# Altium schematic sheet PainRegister_MCU.SchDoc: Электро-регистратор
size 840 x 594 mm; ApprovedBy: Рогов; CheckedBy: Капустин; DrawnBy: Подлесный; DocumentNumber: СКТБ.411126.001 Э3; SheetNumber: 1; SheetTotal: 4; Title1str: болевого синдрома; DocumentType: тип схемы; Format: A1; ImagePath: СКТБ.411126.001
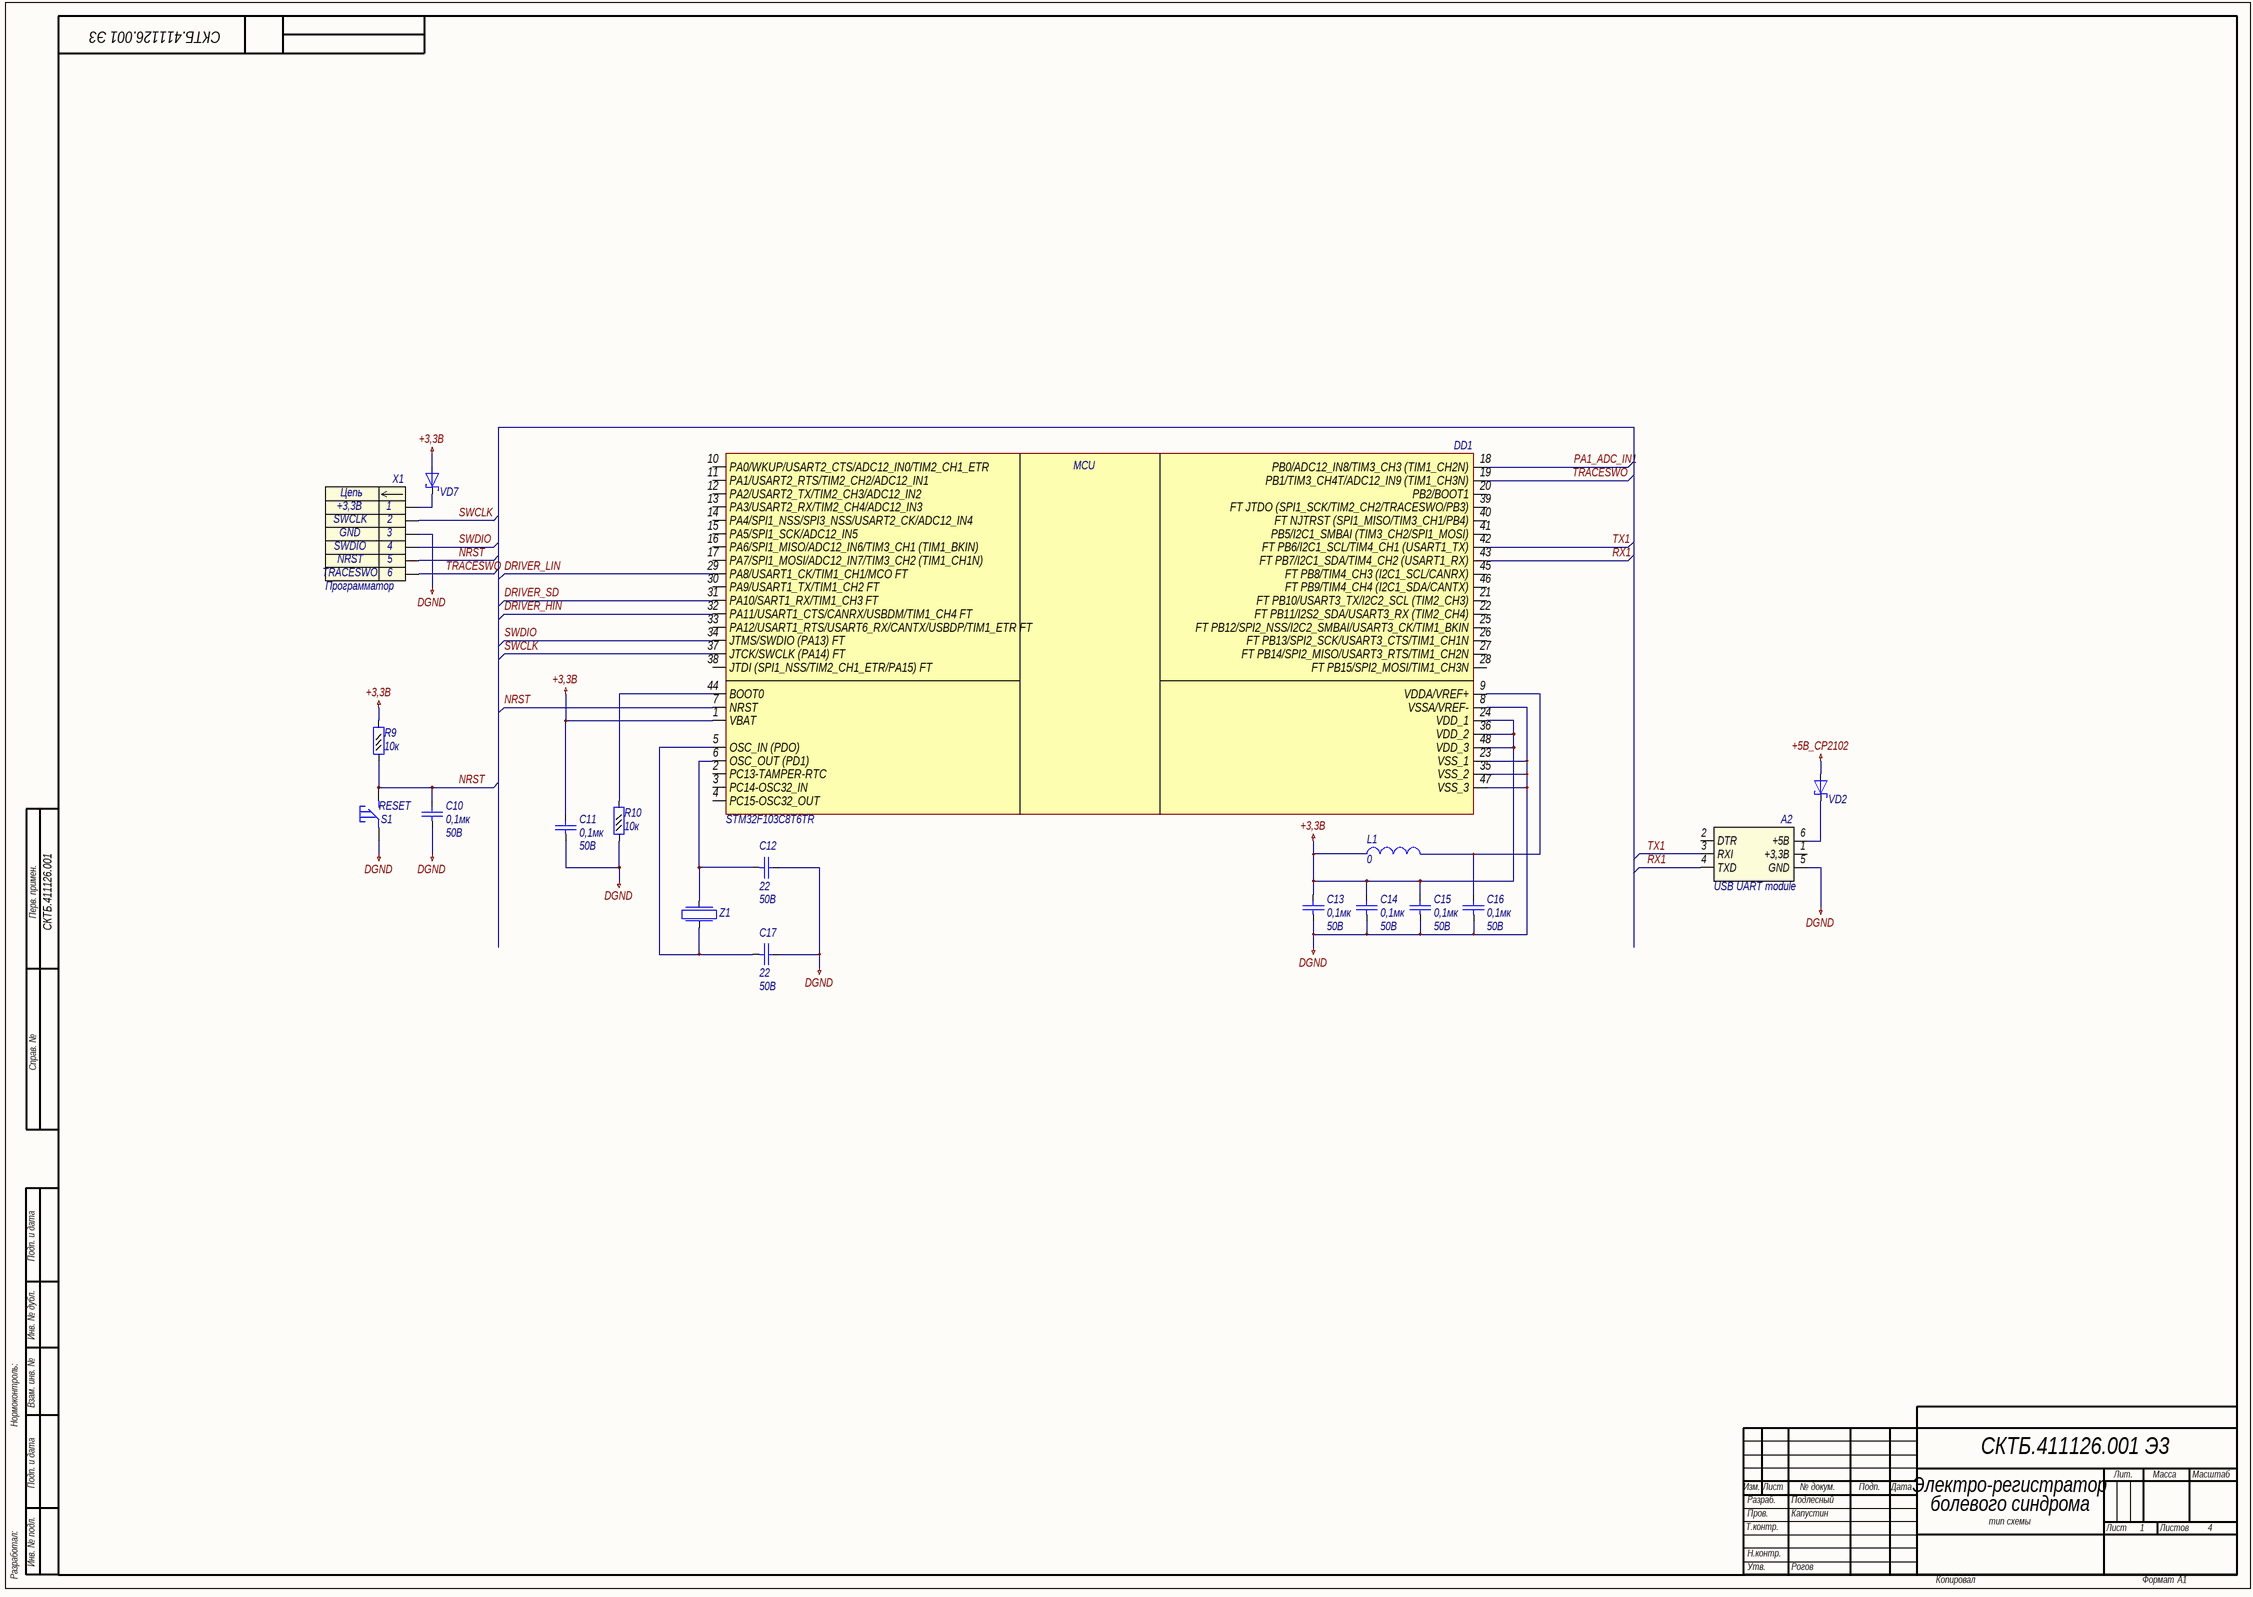
[diagram p0: PainRegister_MCU.SchDoc]

## Parts
A2  USB UART module  [USB UART CP2102]
C10  value 0,1мк  Voltage: 50B  [C0603]  (hidden comment: Capacitor)
C11  value 0,1мк  Voltage: 50B  [C0603]  (hidden comment: Capacitor)
C12  value 22  Voltage: 50B  [C0603]  (hidden comment: Capacitor)
C13  value 0,1мк  Voltage: 50B  [C0603]  (hidden comment: Capacitor)
C14  value 0,1мк  Voltage: 50B  [C0603]  (hidden comment: Capacitor)
C15  value 0,1мк  Voltage: 50B  [C0603]  (hidden comment: Capacitor)
C16  value 0,1мк  Voltage: 50B  [C0603]  (hidden comment: Capacitor)
C17  value 22  Voltage: 50B  [C0603]  (hidden comment: Capacitor)
DD1  STM32F103C8T6TR  [LQFP48]
L1  value 0  [L0603]  (hidden comment: Inductor)
R9  value 10к  [R0603]  (hidden comment: Resistor_0,062Вт)
R10  value 10к  [R0603]  (hidden comment: Resistor_0,062Вт)
S1  RESET  [Button_SMD]
VD2  DiodeSchottky  [SOD-523]  (value not drawn)
VD7  DiodeSchottky  [SOD-523]  (value not drawn)
X1  Программатор  [PLS-6]
Z1  Crystal  [QSMD5.0x3.2x1.0]  (value not drawn)

## Nets
+3,3В: C11.2 C13.2 C14.2 C15.2 DD1.1(VBAT) DD1.24(VDD_1) DD1.36(VDD_2) DD1.48(VDD_3) L1.1 R9.2 VD7.2(A)
+5B_CP2102: VD2.2(A)
DGND: A2.5(GND) C10.1 C11.1 C12.2 C13.1 C14.1 C15.1 C16.1 C17.2 DD1.8(VSSA/VREF-) DD1.23(VSS_1) DD1.35(VSS_2) DD1.47(VSS_3) R10.1 S1.1 X1.3
DRIVER_HIN: DD1.32(PA11/USART1_CTS/CANRX/USBDM/TIM1_CH4_FT)
DRIVER_LIN: DD1.29(PA8/USART1_CK/TIM1_CH1/MCO_FT)
DRIVER_SD: DD1.31(PA10/SART1_RX/TIM1_CH3_FT)
NRST: C10.2 DD1.7(NRST) R9.1 S1.4 X1.5
PA1_ADC_IN1: DD1.18(PB0/ADC12_IN8/TIM3_CH3_(TIM1_CH2N))
RX1: A2.4(TXD) DD1.43(FT_PB7/I2C1_SDA/TIM4_CH2_(USART1_RX))
SWCLK: DD1.37(JTCK/SWCLK_(PA14)_FT) X1.2
SWDIO: DD1.34(JTMS/SWDIO_(PA13)_FT) X1.4
TRACESWO: DD1.19(PB1/TIM3_CH4T/ADC12_IN9_(TIM1_CH3N)) X1.6
TX1: A2.3(RXI) DD1.42(FT_PB6/I2C1_SCL/TIM4_CH1_(USART1_TX))
NetA2_6: A2.6(+5B) VD2.1(K)
NetC12_1: C12.1 DD1.6(OSC_OUT_(PD1)) Z1.2
NetC16_2: C16.2 DD1.9(VDDA/VREF+) L1.2
NetC17_1: C17.1 DD1.5(OSC_IN_(PDO)) Z1.1
NetDD1_44: DD1.44(BOOT0) R10.2
NetVD7_1: VD7.1(K) X1.1

Not connected (* = marked no-connect by the designer): A2 1(+3,3B) 2(DTR); DD1 2(PC13-TAMPER-RTC) 3(PC14-OSC32_IN) 4(PC15-OSC32_OUT) 10(PA0/WKUP/USART2_CTS/ADC12_IN0/TIM2_CH1_ETR) 11(PA1/USART2_RTS/TIM2_CH2/ADC12_IN1) 12(PA2/USART2_TX/TIM2_CH3/ADC12_IN2) 13(PA3/USART2_RX/TIM2_CH4/ADC12_IN3) 14(PA4/SPI1_NSS/SPI3_NSS/USART2_CK/ADC12_IN4) 15(PA5/SPI1_SCK/ADC12_IN5) 16(PA6/SPI1_MISO/ADC12_IN6/TIM3_CH1_(TIM1_BKIN)) 17(PA7/SPI1_MOSI/ADC12_IN7/TIM3_CH2_(TIM1_CH1N)) 20(PB2/BOOT1) 21(FT_PB10/USART3_TX/I2C2_SCL_(TIM2_CH3)) 22(FT_PB11/I2S2_SDA/USART3_RX_(TIM2_CH4)) 25(FT_PB12/SPI2_NSS/I2C2_SMBAI/USART3_CK/TIM1_BKIN) 26(FT_PB13/SPI2_SCK/USART3_CTS/TIM1_CH1N) 27(FT_PB14/SPI2_MISO/USART3_RTS/TIM1_CH2N) 28(FT_PB15/SPI2_MOSI/TIM1_CH3N) 30(PA9/USART1_TX/TIM1_CH2_FT) 33(PA12/USART1_RTS/USART6_RX/CANTX/USBDP/TIM1_ETR_FT) 38(JTDI_(SPI1_NSS/TIM2_CH1_ETR/PA15)_FT) 39(FT_JTDO_(SPI1_SCK/TIM2_CH2/TRACESWO/PB3)) 40(FT_NJTRST_(SPI1_MISO/TIM3_CH1/PB4)) 41(PB5/I2C1_SMBAI_(TIM3_CH2/SPI1_MOSI)) 45(FT_PB8/TIM4_CH3_(I2C1_SCL/CANRX)) 46(FT_PB9/TIM4_CH4_(I2C1_SDA/CANTX))

## Notes on the sheet
- Перв. примен.
- Справ. №
- Подп. и дата
- Инв. № дубл.
- Нормоконтроль:
- Взам. инв. №
- Изм.
- Лист
- № докум.
- Подп.
- Дата
- Лит.
- Масса
- Масштаб
- Т.контр.
- Пров.
- Разраб.
- Листов
- Разработал:
- Инв. № подл.
- Н.контр.
- Утв.
- Копировал
- Формат
- (in symbol connect5) Цепь
- (in symbol microcont0) MСU

## Library data of the parts
A2 = module2: id: module2; Part Name: USB UART CP2102
C10 C11 C13-C16 = cap131: Конденсатор; Part Name: Ceramic; Manufacture: Murata; Part Number: GRM188R71H104KA93D; id: cap131; TKE: X7R
C12 C17 = cap77: Конденсатор; Part Name: Ceramic; Manufacture: Yageo; Part Number: CC0603JRNPO9BN220; id: cap77; TKE: NP0
DD1 = microcont0: Medium-density performance line ARM®-based 32-bit MCU with 64  or 128 KB Flash, USB, CAN, 7 timers, 2 ADCs, 9 com. interfaces; Part Name: Microcontroller; Frequency: 72MHz; ADC: 10x12b; Interface: can, i2c, irda, lin, spi, uart, usb; Flash: 64kb; Pin in: 37; Power Supply: 2.0-3.6 V; id: microcont0; Part Number: STM32F103C8T6TR
L1 = ind0: EMI Suppression Filter; Part Name: EMI Suppression Filters; Part Number: BLM18PG181SN1D; Rated Current: 1,5A; id: ind0; Resistance: 0,09Ohm
R9 R10 = res483: Резистор; Manufacture: Yageo; Part Number: RC0603FR-0710KL; id: res483; Accuracy: 0.01; Part Name: Resistor; Power: 0,062Вт
S1 = btn4: Кнопка; Part Name: Button 5mm; id: btn4
VD2 VD7 = diode12: Диод Шоттки; Part Number: PMEG2010AEB.115; Manufacture: NXP Semiconductor; Max Reverse Voltage: 20B; Forward Voltage: 0,62B; Forward Current: 1А; Breakdown Current: 600uA; Capacitance: 25pF; Number of Channels: 1; id: diode12; Part Name: Diode Schottky
X1 = connect5: Разъем - 6 конт. вилка; Part Number: DS1021-1*6SF112-B; Manufacture: Ningbo connfly electronic; Contact_1: +3,3В; Contact_2: SWCLK; Contact_3: GND; Contact_4: SWDIO; Contact_5: NRST; Contact_6: TRACESWO; Etch: 2,54mm; Part Name: PLS-6; id: connect5
Z1 = crystal0: Кварцевый резонатор; Manufacture: GEYER; Part Number: KX-9A; Frequence: 8MHz; id: crystal0